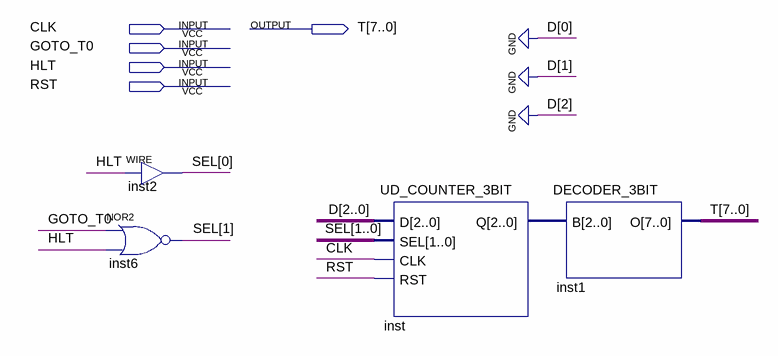
[diagram p0: schematic sheet]
// Quartus schematic TIMER.bdf as structural Verilog: 4 symbols, 5 pins
module TIMER (
  input  CLK,
  input  GOTO_T0,
  input  HLT,
  input  RST,
  output [7:0] T
);

  wire [1:0] SEL;
  wire [2:0] inst_q;

  assign SEL[0] = HLT;  // WIRE inst2
  nor inst6 (SEL[1], GOTO_T0, HLT);
  UD_COUNTER_3BIT inst (.D(3'b000), .SEL(SEL), .CLK(CLK), .RST(RST), .Q(inst_q));
  DECODER_3BIT inst1 (.B(inst_q), .O(T));
endmodule
